# EasyEDA schematic M5 Stick YellowBox Hat_2020-08-21_10-44-11.json

## Sheets
1 YellowBox Hat P1: TITLE: YellowBox Hat (LED Chain, Button Inputs); REV: 1.0; Date: 2020-04-20; Sheet: 1/3; Drawn By: Hans R. Tanner; Company: IoTT - Internet of Toy Trains
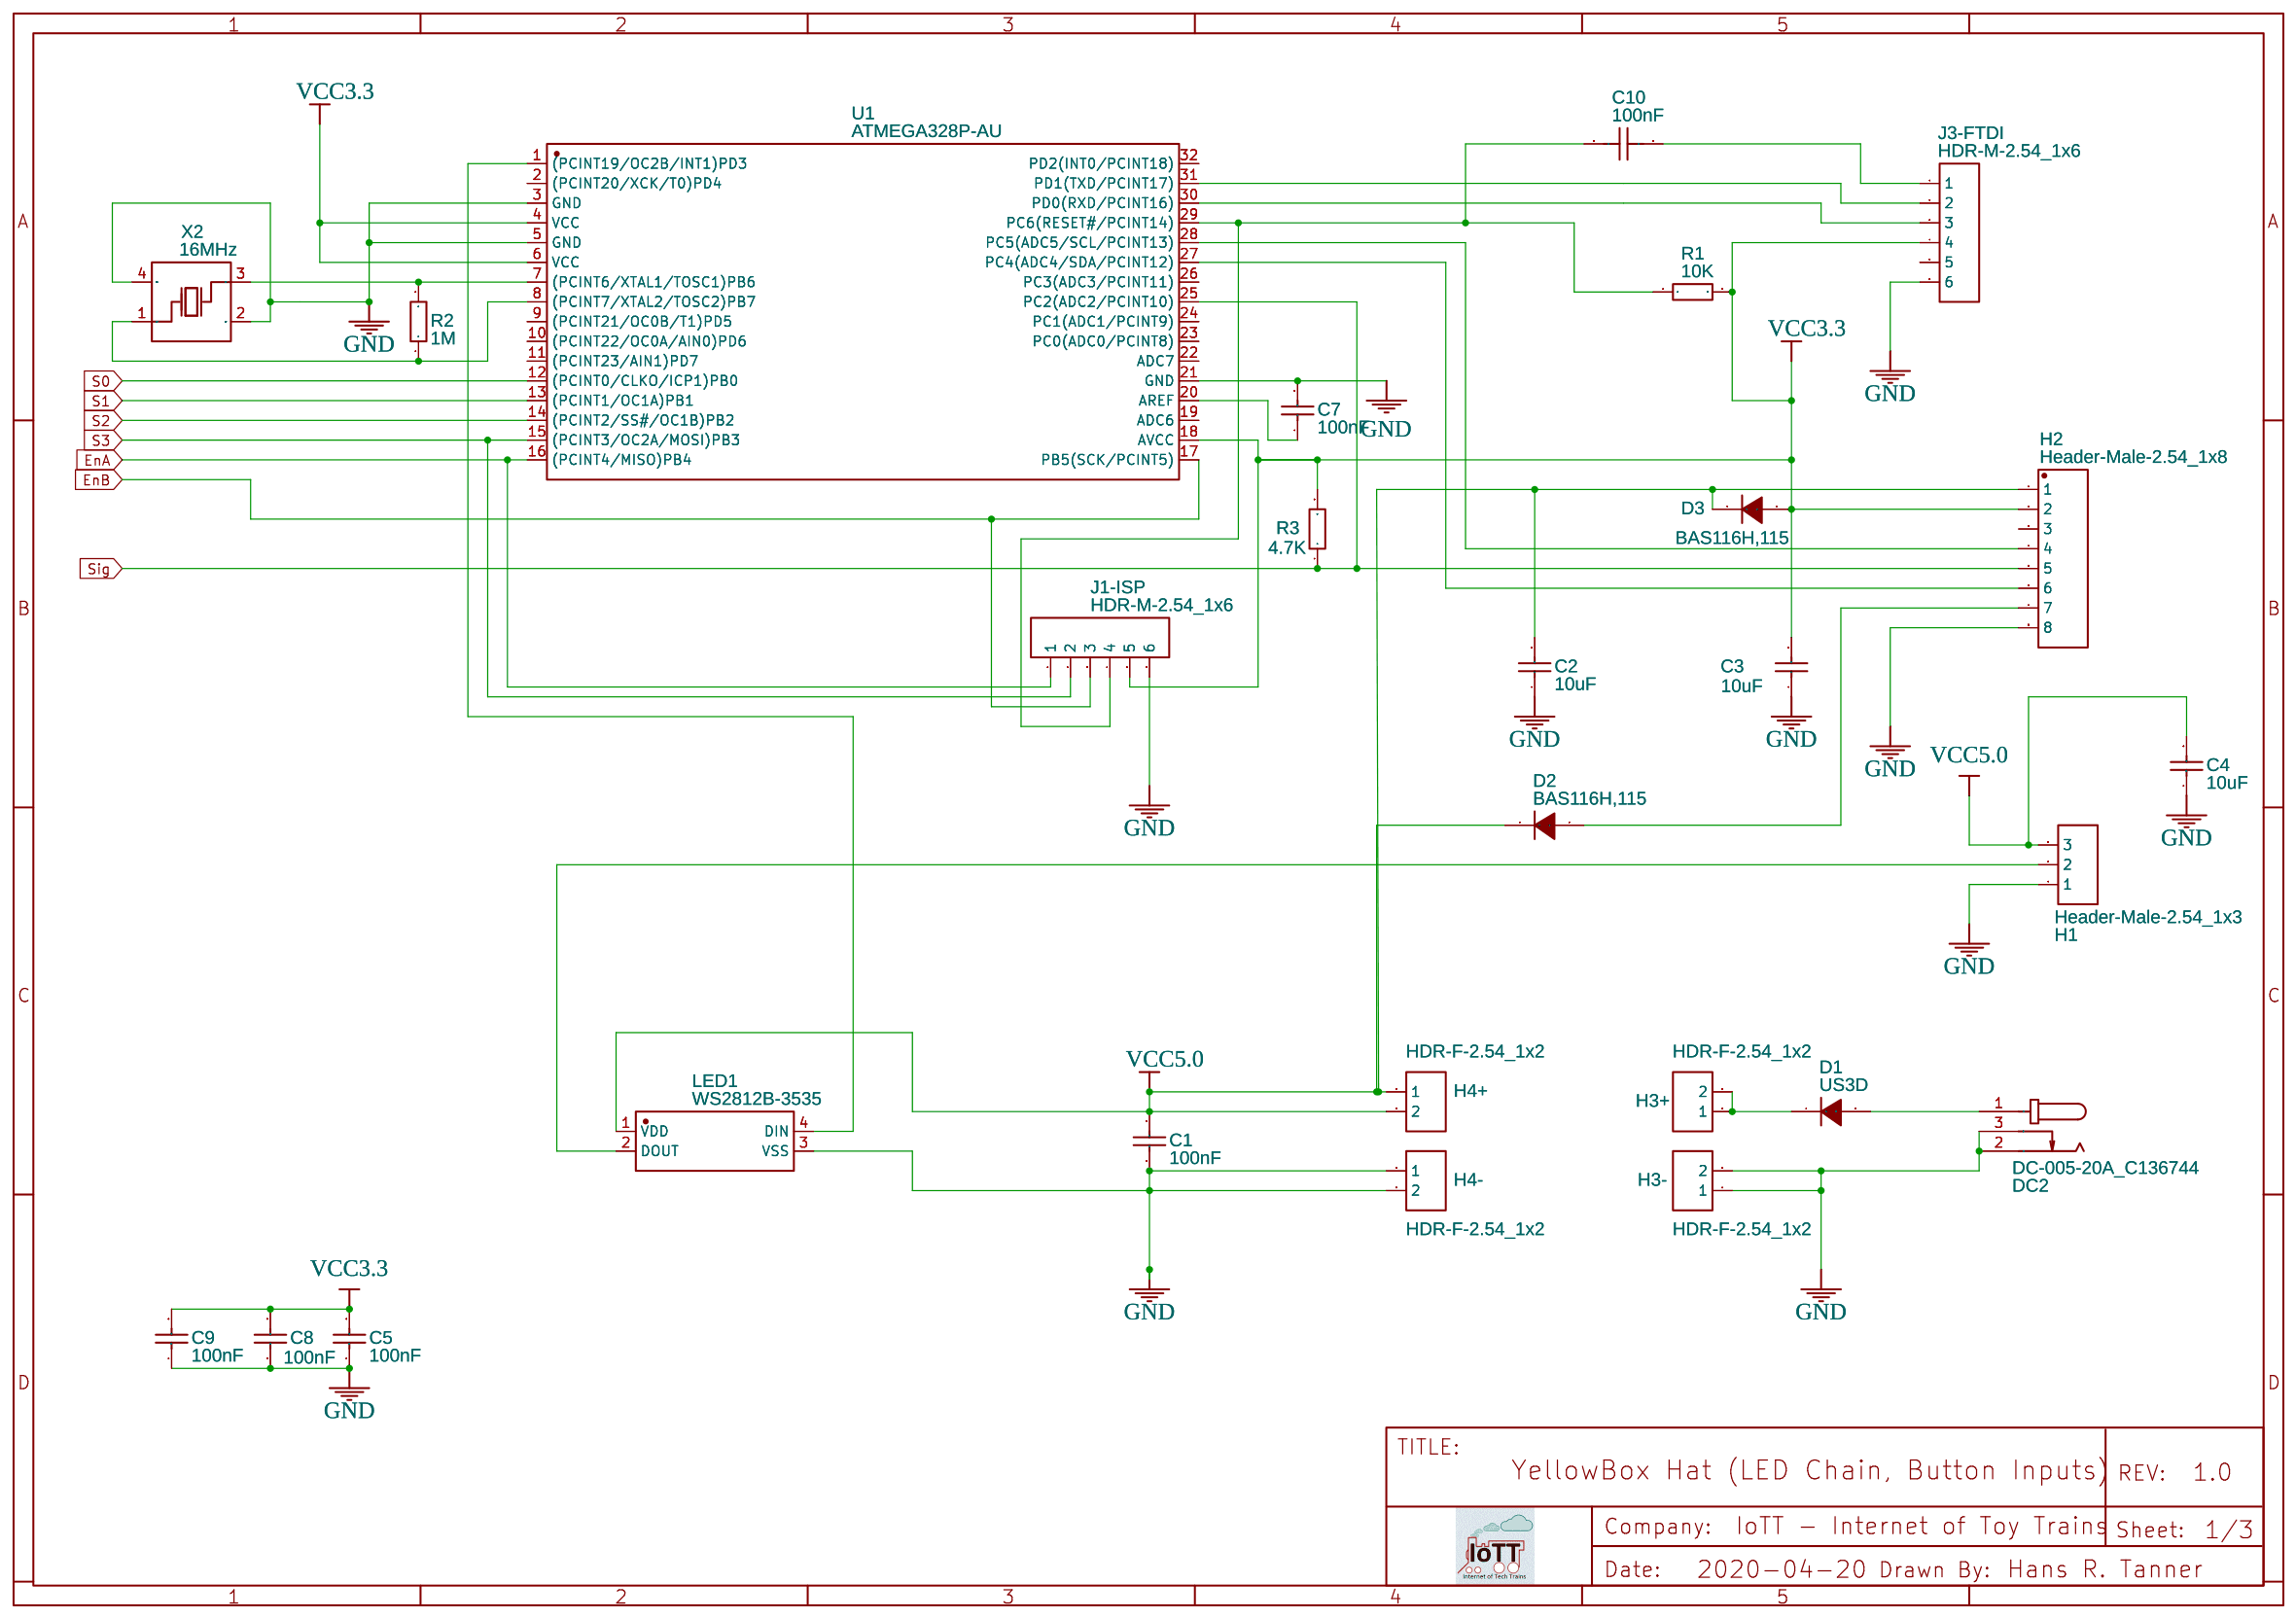
[diagram p0: YellowBox Hat P1]
2 YellowBox Hat P2: Sheet: 2/3
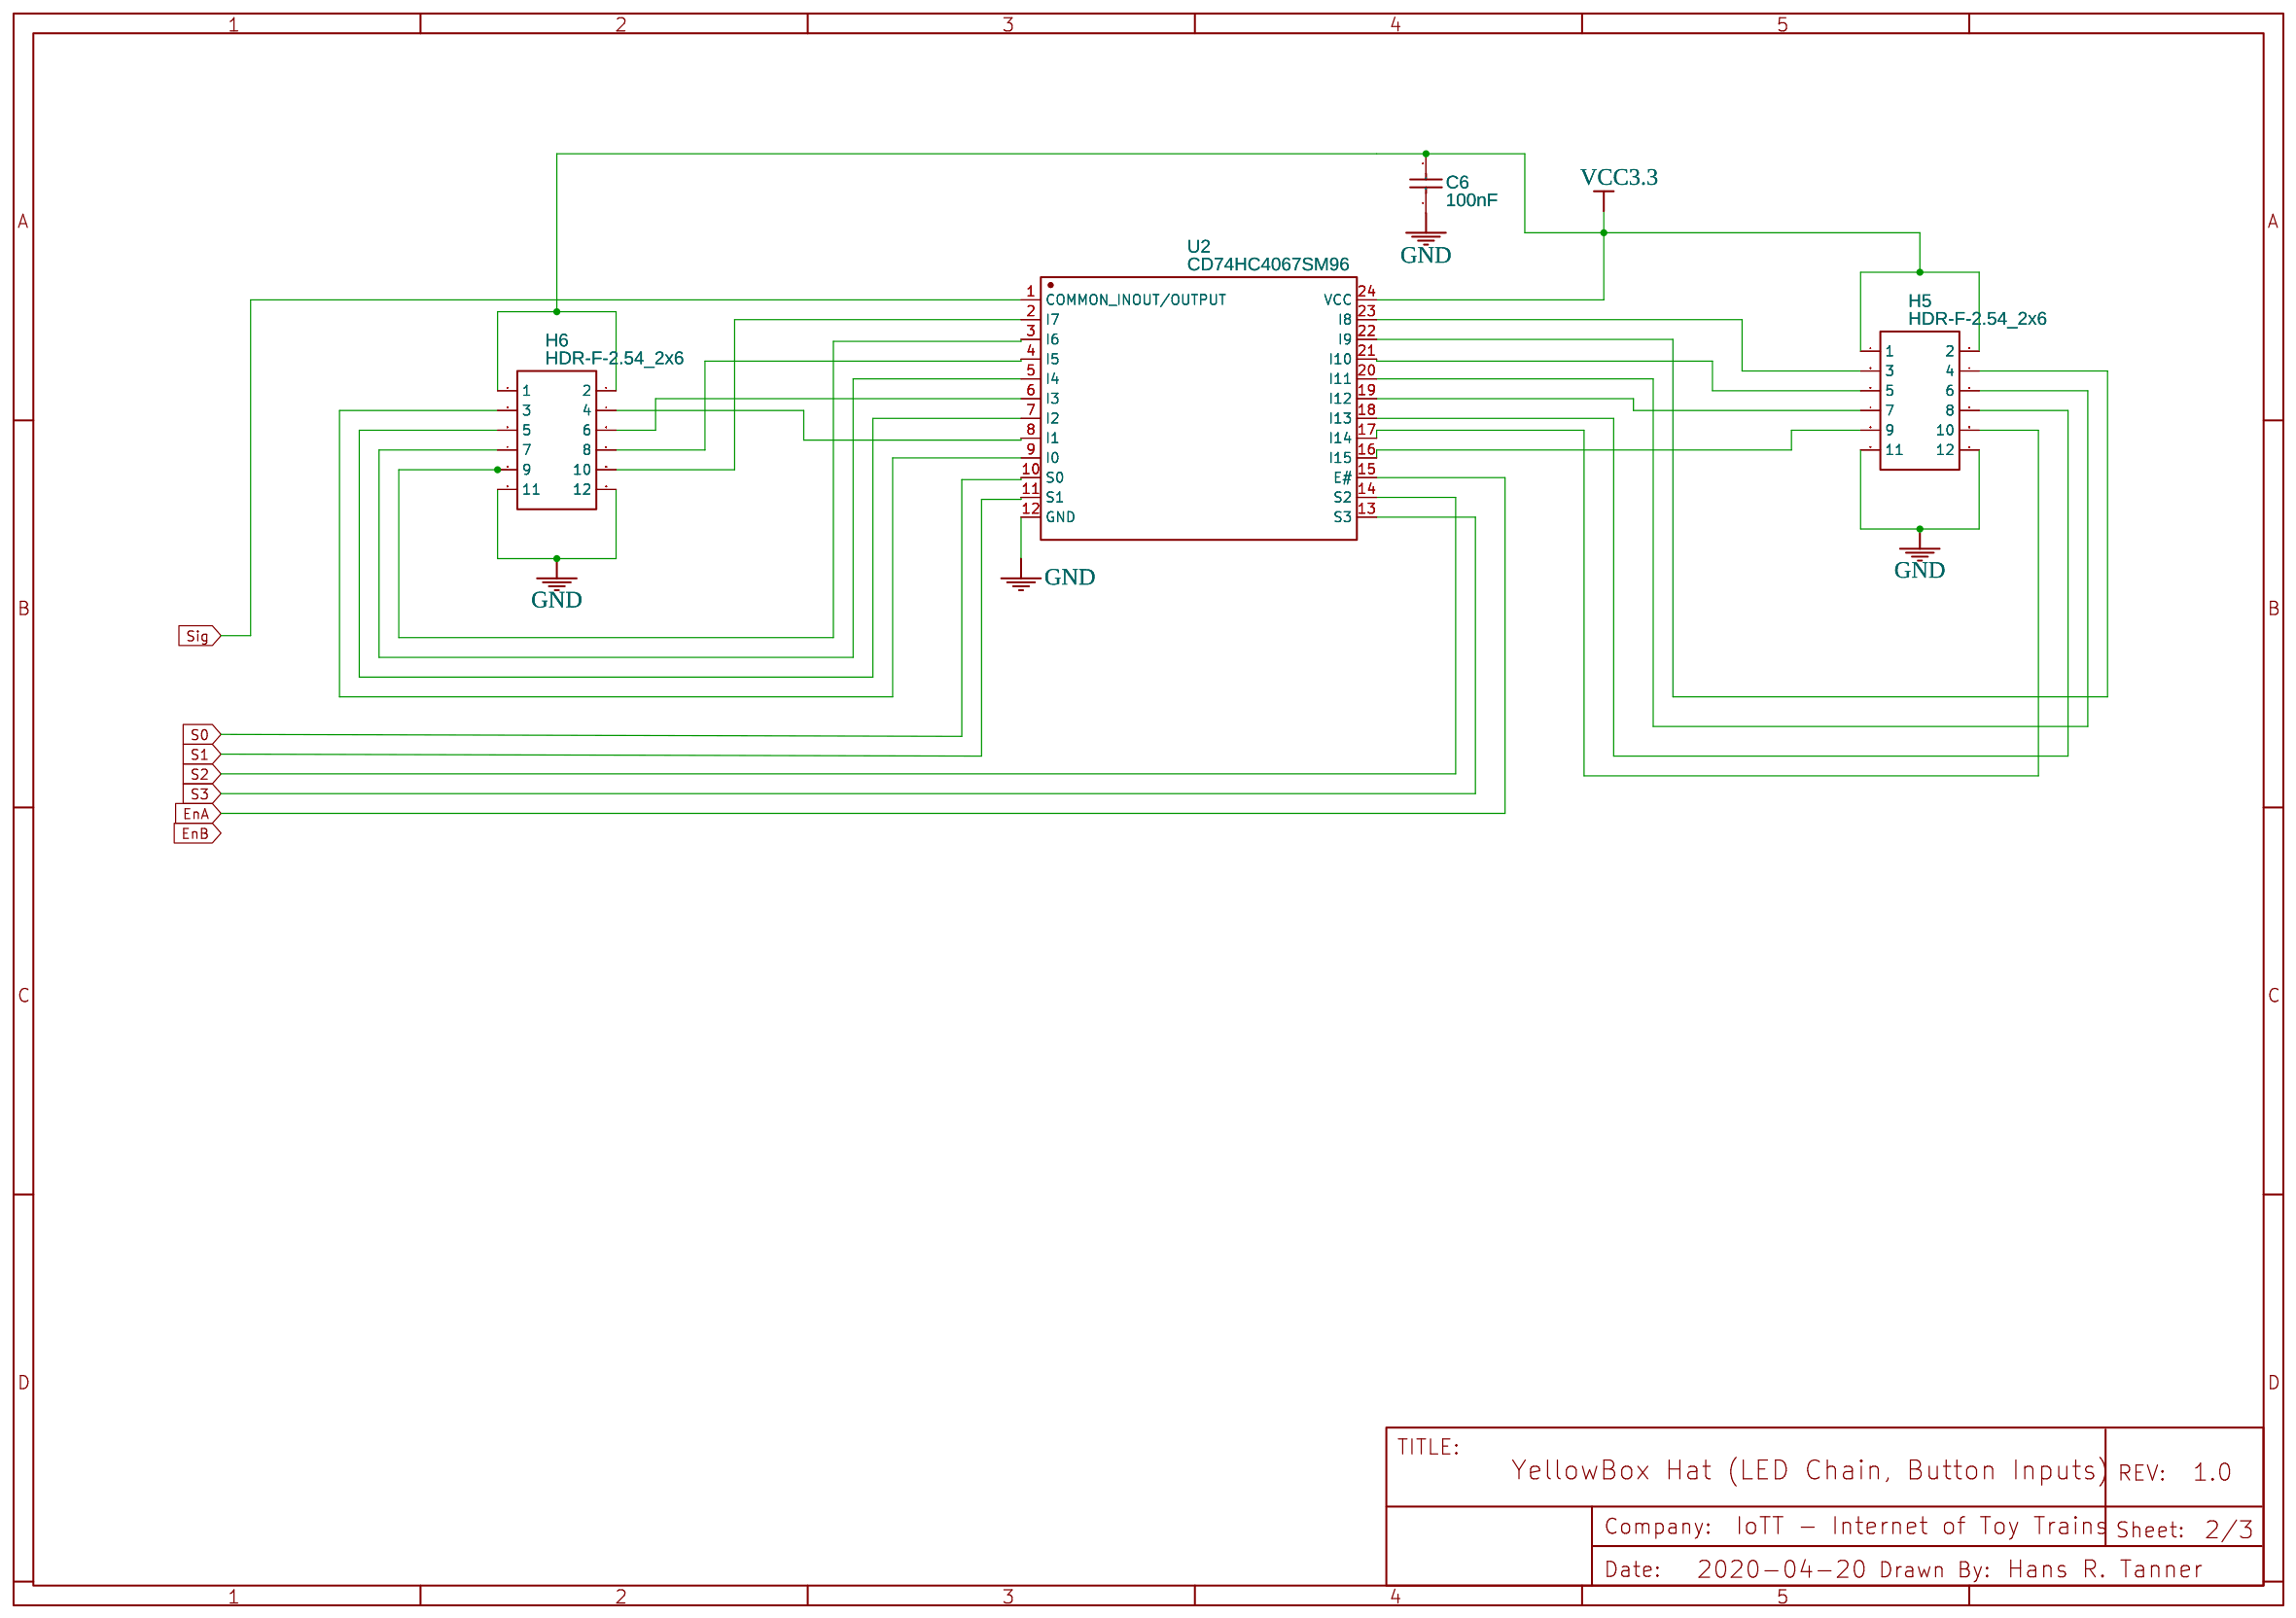
[diagram p1: YellowBox Hat P2]
3 YellowBox Hat P3: Sheet: 3/3
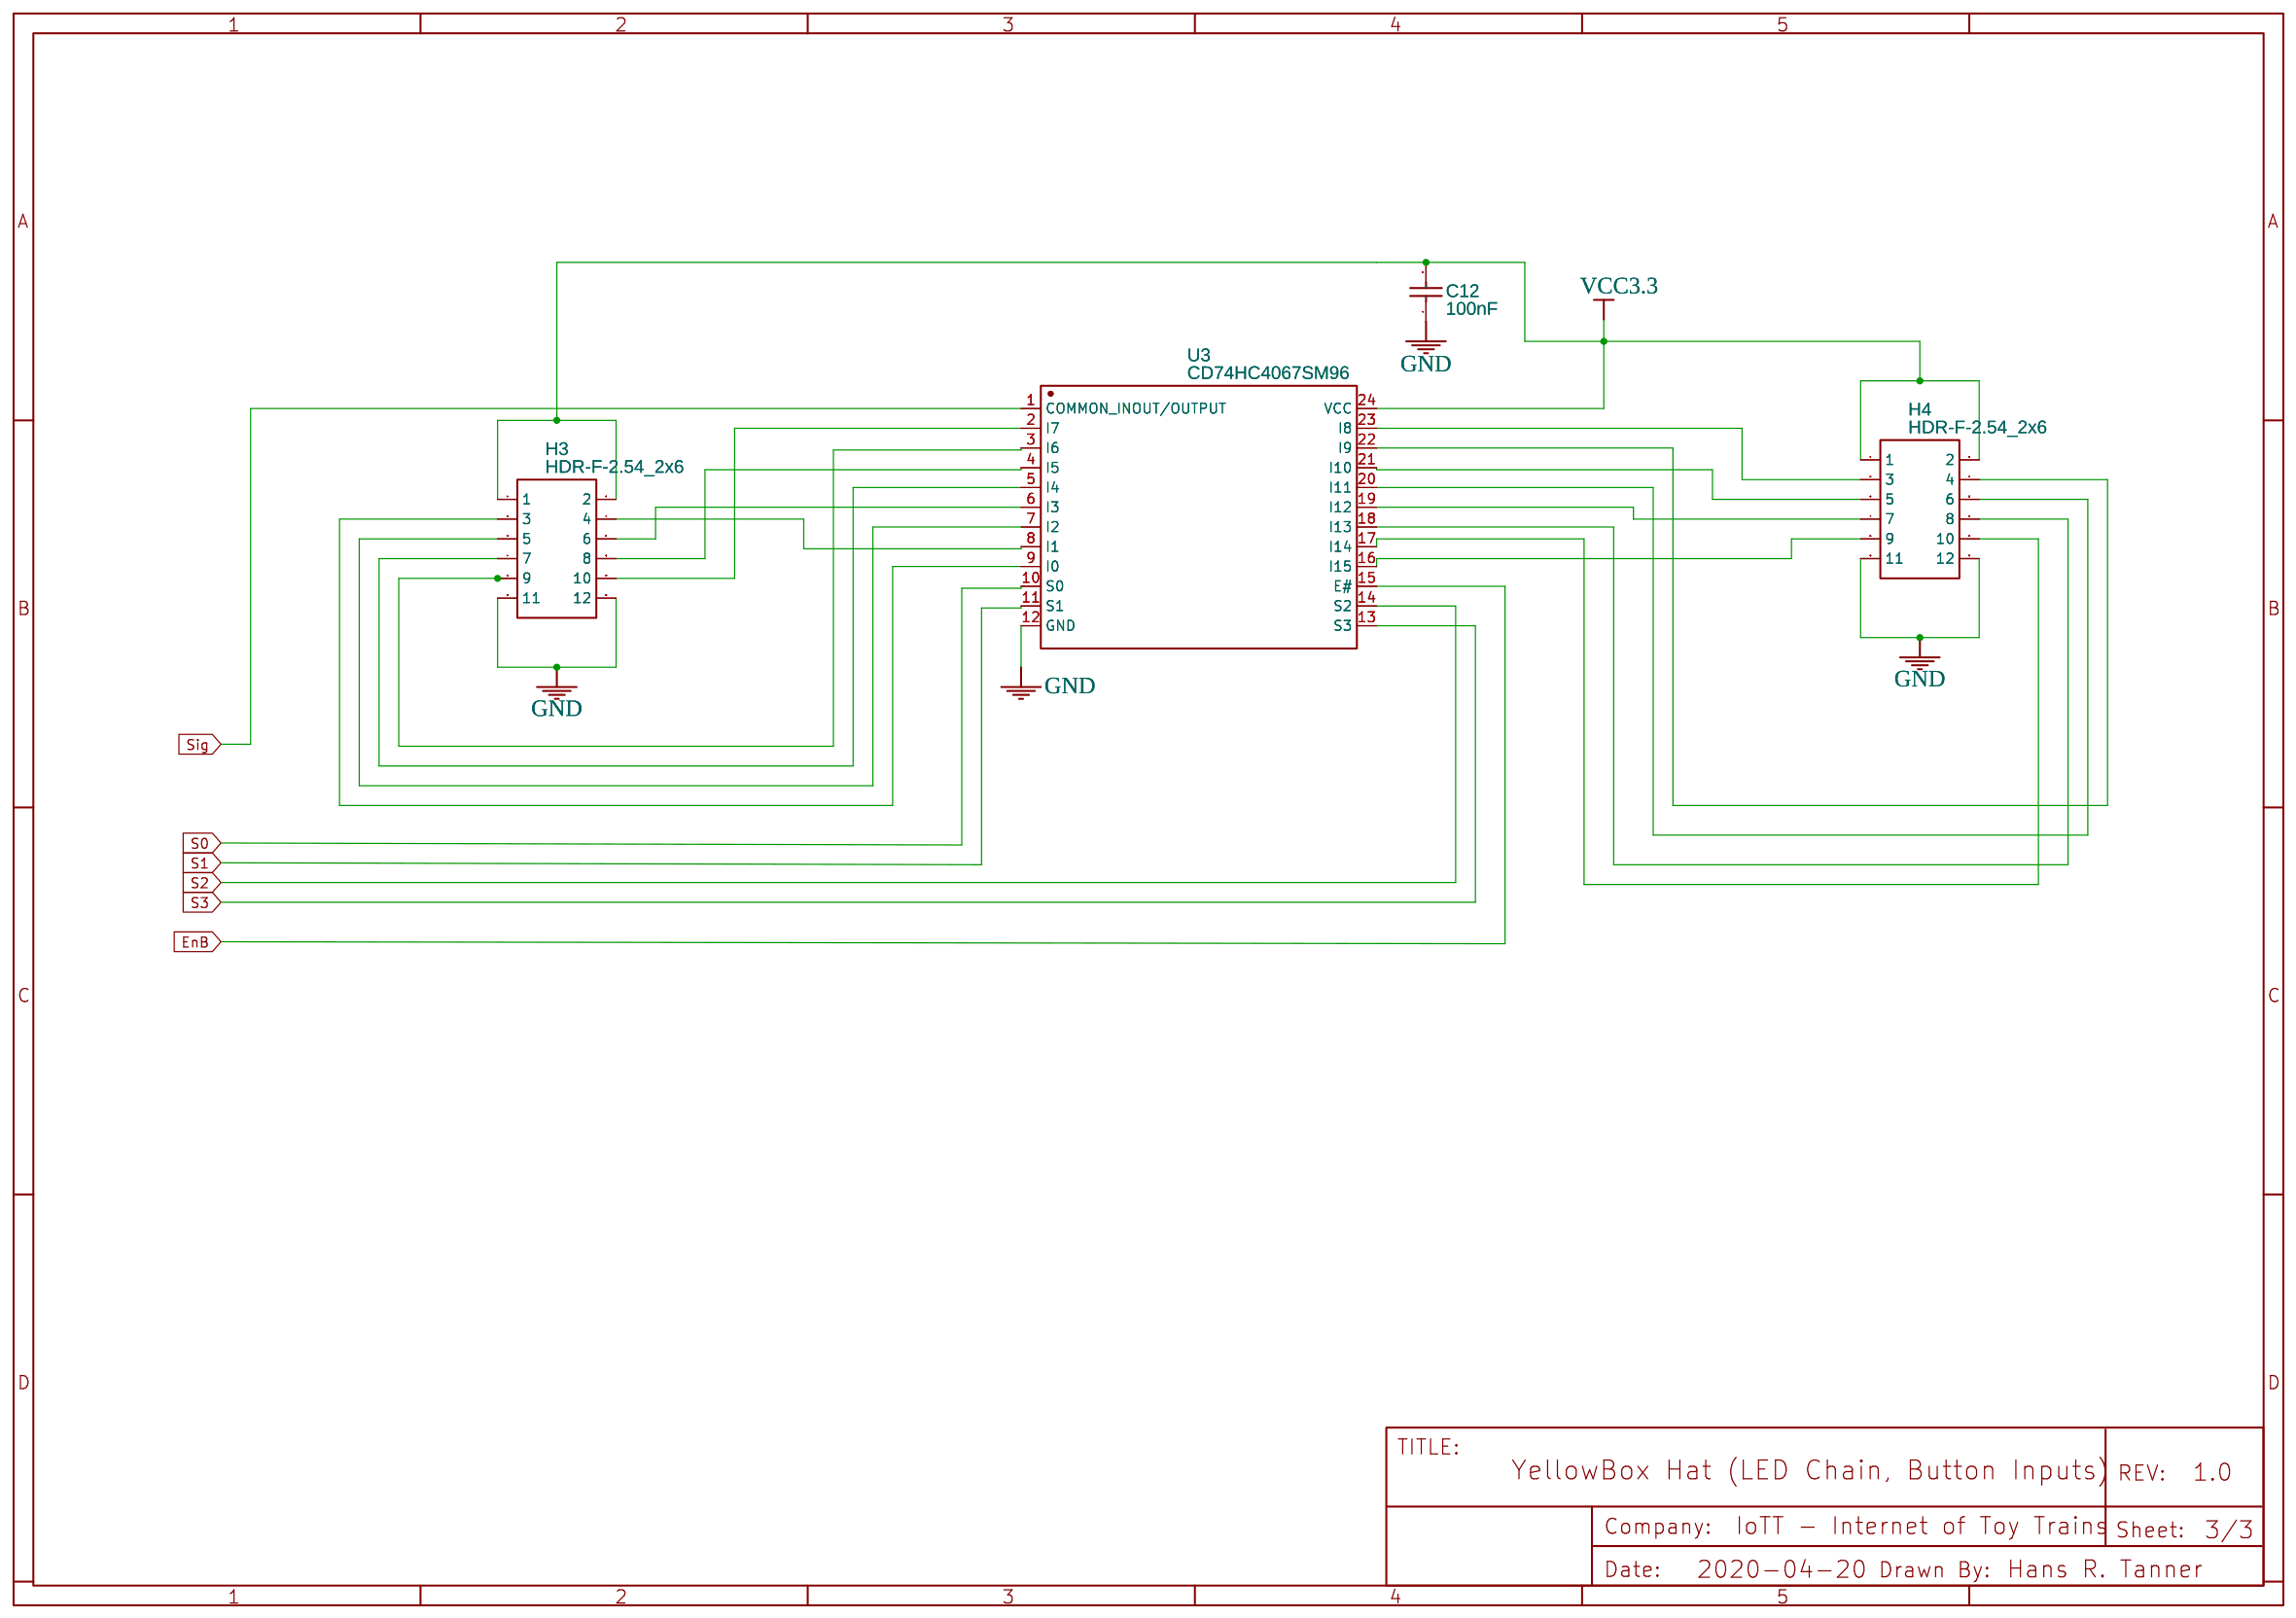
[diagram p2: YellowBox Hat P3]

## Parts
sheet YellowBox Hat P1
C1  100nF  [C0402]
C2  10uF  [C0805]
C3  10uF  [C0805]
C4  10uF  [C0805]
C5  100nF  [C0402]
C7  100nF  [C0402]
C8  100nF  [C0402]
C9  100nF  [C0402]
C10  100nF  [C0603]
D1  US3D  [SMC_L6.9-W5.9-LS7.9-RD]
D2  BAS116H,115  [SOD-123F_L2.8-W1.8-LS3.7-RD]
D3  BAS116H,115  [SOD-123F_L2.8-W1.8-LS3.7-RD]
DC2  DC-005-20A_C136744  [DC-IN-TH_DC-005-20A]
H1  Header-Male-2.54_1x3  [HDR-TH_3P-P2.54-V]
H2  Header-Male-2.54_1x8  [210S-1X8P]
H3+  HDR-F-2.54_1x2  [HDR-F-2.54_1X2]
H3-  HDR-F-2.54_1x2  [HDR-F-2.54_1X2]
H4+  HDR-F-2.54_1x2  [HDR-F-2.54_1X2]
H4-  HDR-F-2.54_1x2  [HDR-F-2.54_1X2]
J1-ISP  HDR-M-2.54_1x6  [HDR-M-2.54_1X6]
J3-FTDI  HDR-M-2.54_1x6  [HDR-M-2.54_1X6]
LED1  WS2812B-3535  [LED-SMD_4P-L3.5-W3.5-TL_WS2812B]
R1  10K  [R0402]
R2  1M  [R0402]
R3  4.7K  [R0603]
U1  ATMEGA328P-AU  [TQFP-32_L7.0-W7.0-P0.80-LS9.0-BL]
X2  16MHz  [OSC-SMD_4P-L3.2-W2.5-BL]
sheet YellowBox Hat P2
C6  100nF  [C0402]
H5  HDR-F-2.54_2x6  [HDR-F-2.54_2X6]
H6  HDR-F-2.54_2x6  [HDR-F-2.54_2X6]
U2  CD74HC4067SM96  [SSOP-24_L8.1-W5.3-P0.65-LS7.8-BL]
sheet YellowBox Hat P3
C12  100nF  [C0402]
H3  HDR-F-2.54_2x6  [HDR-F-2.54_2X6]
H4  HDR-F-2.54_2x6  [HDR-F-2.54_2X6]
U3  CD74HC4067SM96  [SSOP-24_L8.1-W5.3-P0.65-LS7.8-BL]

## Library data of the parts
C1 C5-C9 C12 = CL05B104KO5NNNC: Supplier: LCSC; Manufacturer: SAMSUNG; LCSC Assembly: Yes; Supplier Part: C1525; SMT Type: Basic
C2-C4 = CL21A106KAYNNNE: Supplier: LCSC; Manufacturer: SAMSUNG; LCSC Assembly: Yes; Supplier Part: C15850; SMT Type: Basic
C10 = CC0603KRX7R9BB104: Supplier: LCSC; Manufacturer: YAGEO; LCSC Assembly: Yes; Supplier Part: C14663; SMT Type: Basic
D1 = US3D: Supplier: LCSC; Manufacturer: MDD; Supplier Part: C64964; LCSC Assembly: Yes; SMT Type: Extend
D2 D3 = BAS116H,115: Supplier: LCSC; Manufacturer: Nexperia; Contributor: LCSC; Supplier Part: C74210; LCSC Assembly: Yes; SMT Type: Extend
DC2 = DC-005-20A_C136744: Supplier: LCSC; Manufacturer: HRO; Manufacturer Part: DC-005-20A; Contributor: LCSC; Supplier Part: C136744
H1 = Header-Male-2.54_1x3: Supplier: LCSC; Manufacturer: BOOMELE; Manufacturer Part: Header2.54mm 1*3P; image: //image.lceda.cn/szlcsc/C49257.jpg; Supplier Part: C49257
H2 = Header-Male-2.54_1x8: Supplier: LCSC; Manufacturer: Ckmtw; Manufacturer Part: 210S-1*8P L=11.6MMGold-plated black; Contributor: LCSC; Supplier Part: C124381
H3+ H3- H4+ H4- = HDR-F-2.54_1x2: Supplier Part: C49661; Supplier: LCSC; Contributor: LCEDA_Lib
J1-ISP J3-FTDI = HDR-M-2.54_1x6: Supplier Part: C190819; Supplier: LCSC; Contributor: LCEDA_Lib
LED1 = WS2812B-3535: Supplier: LCSC; Manufacturer: Worldsemi; Contributor: LCSC; Supplier Part: C114583; LCSC Assembly: Yes; SMT Type: Extend
R1 = 0402WGF1002TCE: Supplier: LCSC; Manufacturer: UniOhm; LCSC Assembly: Yes; Supplier Part: C25744; SMT Type: Basic
R2 = 0402WGF1004TCE: Supplier: LCSC; Manufacturer: UniOhm; LCSC Assembly: Yes; Supplier Part: C26083; SMT Type: Basic
R3 = 0603WAF1001T5E: Supplier: LCSC; Manufacturer: UniOhm; Manufacturer Part: 0603WAF4701T5E; LCSC Assembly: Yes; Supplier Part: C23162; SMT Type: Basic
U1 = ATMEGA328P-AU: Supplier: LCSC; Manufacturer: MICROCHIP; image: //image.lceda.cn/szlcsc/C14877.jpg; Supplier Part: C14877; LCSC Assembly: Yes; SMT Type: Extend
X2 = X322516MLB4SI: Supplier: LCSC; Manufacturer: YXC; LCSC Assembly: Yes; Supplier Part: C13738; SMT Type: Basic
H3-H6 = HDR-F-2.54_2x6: Supplier Part: C36191; Supplier: LCSC; Contributor: LCEDA_Lib
U2 U3 = CD74HC4067SM96: Supplier: LCSC; Manufacturer: TI; Supplier Part: C98457; LCSC Assembly: Yes; SMT Type: Extend

## Nets
GND: C1.1 C2.1 C3.1 C4.1 C5.1 C6.1 C7.2 C8.1 C9.1 C12.1 DC2.2 DC2.3 H1.1 H2.8 H3.11 H3.12 H3-.1 H3-.2 H4.11 H4.12 H4-.1 H4-.2 H5.11 H5.12 H6.11 H6.12 J1-ISP.6 J3-FTDI.6 LED1.3(VSS) U1.3(GND) U1.5(GND) U1.21(GND) U2.12(GND) U3.12(GND) X2.2(GND) X2.4(GND)
VCC3.3: C3.2 C5.2 C6.2 C8.2 C9.2 C12.2 D3.2(A) H2.2 H3.1 H3.2 H4.1 H4.2 H5.1 H5.2 H6.1 H6.2 J1-ISP.5 J3-FTDI.4 R1.2 R3.2 U1.4(VCC) U1.6(VCC) U1.18(AVCC) U2.24(VCC) U3.24(VCC)
VCC5.0: C1.2 C2.2 C4.2 D2.1(K) D3.1(K) H1.3 H2.1 H4+.1 H4+.2 LED1.1(VDD)
EnA: J1-ISP.1 U1.16((PCINT4/MISO)PB4) U2.15(E#)
EnB: J1-ISP.3 U1.17(PB5(SCK/PCINT5)) U3.15(E#)
S0: U1.12((PCINT0/CLKO/ICP1)PB0) U2.10(S0) U3.10(S0)
S1: U1.13((PCINT1/OC1A)PB1) U2.11(S1) U3.11(S1)
S2: U1.14((PCINT2/SS#/OC1B)PB2) U2.14(S2) U3.14(S2)
S3: J1-ISP.2 U1.15((PCINT3/OC2A/MOSI)PB3) U2.13(S3) U3.13(S3)
Sig: H2.5 R3.1 U1.25(PC2(ADC2/PCINT10)) U2.1(COMMON INOUT/OUTPUT) U3.1(COMMON INOUT/OUTPUT)
Net-(C7-1): C7.1 U1.20(AREF)
Net-(C10-1): C10.1 J1-ISP.4 R1.1 U1.29(PC6(RESET#/PCINT14))
Net-(C10-2): C10.2 J3-FTDI.1
Net-(D1-1): D1.1 H3+.1 H3+.2
Net-(D1-2): D1.2 DC2.1
Net-(D2-2): D2.2(A) H2.7
Net-(H1-2): H1.2 LED1.2(DOUT)
Net-(H2-4): H2.4 U1.28(PC5(ADC5/SCL/PCINT13))
Net-(H2-6): H2.6 U1.27(PC4(ADC4/SDA/PCINT12))
Net-(H3-3): H3.3 U3.9(I0)
Net-(H3-4): H3.4 U3.8(I1)
Net-(H3-5): H3.5 U3.7(I2)
Net-(H3-6): H3.6 U3.6(I3)
Net-(H3-7): H3.7 U3.5(I4)
Net-(H3-8): H3.8 U3.4(I5)
Net-(H3-9): H3.9 U3.3(I6)
Net-(H3-10): H3.10 U3.2(I7)
Net-(H4-3): H4.3 U3.23(I8)
Net-(H4-4): H4.4 U3.22(I9)
Net-(H4-5): H4.5 U3.21(I10)
Net-(H4-6): H4.6 U3.20(I11)
Net-(H4-7): H4.7 U3.19(I12)
Net-(H4-8): H4.8 U3.18(I13)
Net-(H4-9): H4.9 U3.16(I15)
Net-(H4-10): H4.10 U3.17(I14)
Net-(H5-3): H5.3 U2.23(I8)
Net-(H5-4): H5.4 U2.22(I9)
Net-(H5-5): H5.5 U2.21(I10)
Net-(H5-6): H5.6 U2.20(I11)
Net-(H5-7): H5.7 U2.19(I12)
Net-(H5-8): H5.8 U2.18(I13)
Net-(H5-9): H5.9 U2.16(I15)
Net-(H5-10): H5.10 U2.17(I14)
Net-(H6-3): H6.3 U2.9(I0)
Net-(H6-4): H6.4 U2.8(I1)
Net-(H6-5): H6.5 U2.7(I2)
Net-(H6-6): H6.6 U2.6(I3)
Net-(H6-7): H6.7 U2.5(I4)
Net-(H6-8): H6.8 U2.4(I5)
Net-(H6-9): H6.9 U2.3(I6)
Net-(H6-10): H6.10 U2.2(I7)
Net-(J3-FTDI-2): J3-FTDI.2 U1.31(PD1(TXD/PCINT17))
Net-(J3-FTDI-3): J3-FTDI.3 U1.30(PD0(RXD/PCINT16))
Net-(LED1-4): LED1.4(DIN) U1.1((PCINT19/OC2B/INT1)PD3)
Net-(R2-1): R2.1 U1.8((PCINT7/XTAL2/TOSC2)PB7) X2.1(OSC1)
Net-(R2-2): R2.2 U1.7((PCINT6/XTAL1/TOSC1)PB6) X2.3(OSC2)

Not connected (* = marked no-connect by the designer): H2 3; J3-FTDI 5; U1 2((PCINT20/XCK/T0)PD4) 9((PCINT21/OC0B/T1)PD5) 10((PCINT22/OC0A/AIN0)PD6) 11((PCINT23/AIN1)PD7) 19(ADC6) 22(ADC7) 23(PC0(ADC0/PCINT8)) 24(PC1(ADC1/PCINT9)) 26(PC3(ADC3/PCINT11)) 32(PD2(INT0/PCINT18))
